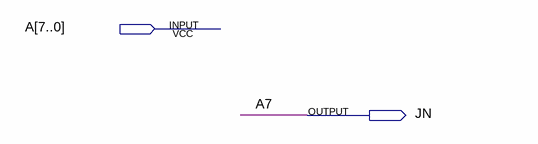
[diagram p0: schematic sheet]
// Quartus schematic JN_end.bdf as structural Verilog: 0 symbols, 2 pins
module JN_end (
  input  [7:0] A,
  output JN
);


  assign JN = A[7];
endmodule
